# EAGLE design eggbothat (EAGLE 7.7.0)

## Sheet 1 of 2
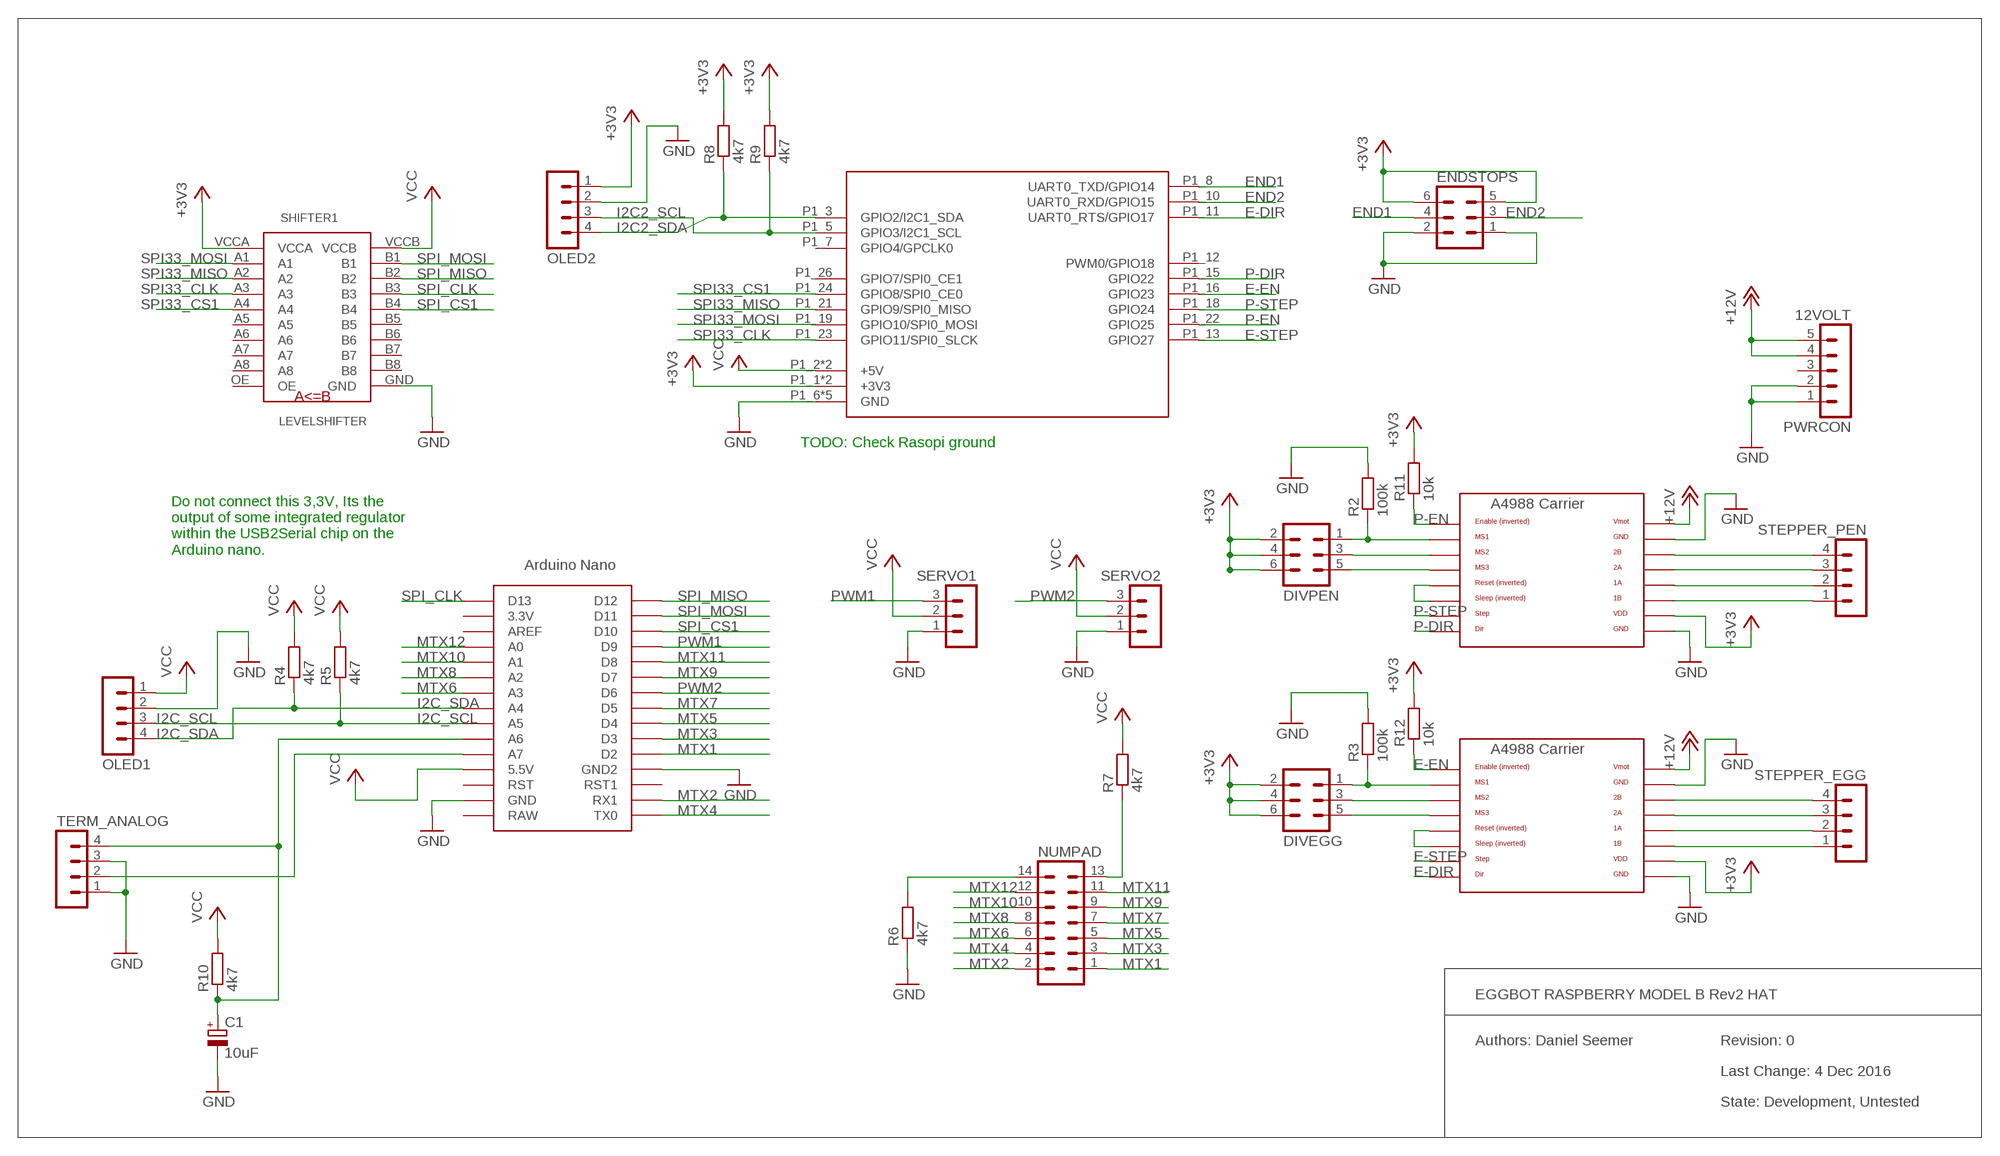
[diagram p0: schematic, sheet 1]

### Parts
12VOLT  PWRCON  MA05-1  [MA05-1]
C1  10uF  CPOL-EUE2.5-5  [E2,5-5]
DIVEGG  MA03-2  [MA03-2]
DIVPEN  MA03-2  [MA03-2]
ENDSTOPS  MA03-2  [MA03-2]
NUMPAD  MA07-2  [MA07-2]
OLED1  MA04-1  [MA04-1]
OLED2  MA04-1  [MA04-1]
R2  100k  R-EU_R1206  [R1206]
R3  100k  R-EU_R1206  [R1206]
R4  4k7  R-EU_R1206  [R1206]
R5  4k7  R-EU_R1206  [R1206]
R6  4k7  R-EU_R1206  [R1206]
R7  4k7  R-EU_R1206  [R1206]
R8  4k7  R-EU_R1206  [R1206]
R9  4k7  R-EU_R1206  [R1206]
R10  4k7  R-EU_R1206  [R1206]
R11  10k  R-EU_R1206  [R1206]
R12  10k  R-EU_R1206  [R1206]
RASPBERRY  RPI-B-V2SHIELD  [RPI-B-V2-SHIELD]
SERVO1  MA03-1  [MA03-1]
SERVO2  MA03-1  [MA03-1]
SHIFTER1  LEVELSHIFTER  [PLUG_20_S4]
STEPPER_EGG  MA04-1  [MA04-1]
STEPPER_PEN  MA04-1  [MA04-1]
TERM_ANALOG  MA04-1  [MA04-1]
U$1  A4988BREAKOUT  [A4988BREAKOUT]
U$2  A4988BREAKOUT  [A4988BREAKOUT]
U$4  NANO  [NANO]

### Nets
+3V3: DIVEGG.2 DIVEGG.4 DIVEGG.6 DIVPEN.2 DIVPEN.4 DIVPEN.6 ENDSTOPS.5 ENDSTOPS.6 OLED2.1 R8.2 R9.2 R11.2 R12.2 RASPBERRY.P1_1(+3V3) RASPBERRY.P1_17(+3V3) SHIFTER1.VCCA U$1.VDD U$2.VDD
+12V: 12VOLT.4 12VOLT.5 U$1.VMOT U$2.VMOT
E-DIR: RASPBERRY.P1_11(UART0_RTS/GPIO17) U$2.DIR
E-EN: R12.1 RASPBERRY.P1_16(GPIO23) U$2.EN
E-STEP: RASPBERRY.P1_13(GPIO27) U$2.STEP
END1: ENDSTOPS.4 RASPBERRY.P1_8(UART0_TXD/GPIO14)
END2: ENDSTOPS.3 RASPBERRY.P1_10(UART0_RXD/GPIO15)
GND: 12VOLT.1 12VOLT.2 C1.- ENDSTOPS.1 ENDSTOPS.2 OLED1.2 OLED2.2 R2.2 R3.2 R6.1 RASPBERRY.P1_6(GND) RASPBERRY.P1_9(GND) RASPBERRY.P1_14(GND) RASPBERRY.P1_20(GND) RASPBERRY.P1_25(GND) SERVO1.1 SERVO2.1 SHIFTER1.GND TERM_ANALOG.1 TERM_ANALOG.3 U$1.GND U$1.GND@0(GND) U$2.GND U$2.GND@0(GND) U$4.GND U$4.GND1(GND2)
I2C2_SCL: OLED2.3 R9.1 RASPBERRY.P1_5(GPIO3/I2C1_SCL)
I2C2_SDA: OLED2.4 R8.1 RASPBERRY.P1_3(GPIO2/I2C1_SDA)
I2C_SCL: OLED1.3 R5.1 U$4.A5
I2C_SDA: OLED1.4 R4.1 U$4.A4
MTX1: NUMPAD.1 U$4.D2
MTX2: NUMPAD.2 U$4.RX1
MTX3: NUMPAD.3 U$4.D3
MTX4: NUMPAD.4 U$4.TX0
MTX5: NUMPAD.5 U$4.D4
MTX6: NUMPAD.6 U$4.A3
MTX7: NUMPAD.7 U$4.D5
MTX8: NUMPAD.8 U$4.A2
MTX9: NUMPAD.9 U$4.D7
MTX10: NUMPAD.10 U$4.A1
MTX11: NUMPAD.11 U$4.D8
MTX12: NUMPAD.12 U$4.A0
N$1: STEPPER_PEN.4 U$1.2B
N$2: STEPPER_PEN.3 U$1.2A
N$3: STEPPER_PEN.2 U$1.1A
N$4: STEPPER_PEN.1 U$1.1B
N$5: STEPPER_EGG.4 U$2.2B
N$6: STEPPER_EGG.3 U$2.2A
N$7: STEPPER_EGG.2 U$2.1A
N$8: STEPPER_EGG.1 U$2.1B
N$9: DIVPEN.3 U$1.MS2
N$10: DIVPEN.1 R2.1 U$1.MS1
N$11: DIVPEN.5 U$1.MS3
N$12: DIVEGG.3 U$2.MS2
N$13: DIVEGG.1 R3.1 U$2.MS1
N$14: DIVEGG.5 U$2.MS3
N$16: NUMPAD.13 R7.1
N$17: NUMPAD.14 R6.2
N$18: U$1.RST U$1.SLP(SLEEP)
N$19: U$2.RST U$2.SLP(SLEEP)
N$20: C1.+ R10.1 TERM_ANALOG.4 U$4.A6
N$21: TERM_ANALOG.2 U$4.A7
P-DIR: RASPBERRY.P1_15(GPIO22) U$1.DIR
P-EN: R11.1 RASPBERRY.P1_22(GPIO25) U$1.EN
P-STEP: RASPBERRY.P1_18(GPIO24) U$1.STEP
PWM1: SERVO1.3 U$4.D9
PWM2: SERVO2.3 U$4.D6
SPI33_CLK: RASPBERRY.P1_23(GPIO11/SPI0_SLCK) SHIFTER1.A3
SPI33_CS1: RASPBERRY.P1_24(GPIO8/SPI0_CE0) SHIFTER1.A4
SPI33_MISO: RASPBERRY.P1_21(GPIO9/SPI0_MISO) SHIFTER1.A2
SPI33_MOSI: RASPBERRY.P1_19(GPIO10/SPI0_MOSI) SHIFTER1.A1
SPI_CLK: SHIFTER1.B3 U$4.D13
SPI_CS1: SHIFTER1.B4 U$4.D10
SPI_MISO: SHIFTER1.B2 U$4.D12
SPI_MOSI: SHIFTER1.B1 U$4.D11
VCC: OLED1.1 R4.2 R5.2 R7.2 R10.2 RASPBERRY.P1_2(+5V) RASPBERRY.P1_4(+5V) SERVO1.2 SERVO2.2 SHIFTER1.VCCB U$4.5V(5.5V)
Unconnected: 12VOLT.3 RASPBERRY.P1_7(GPIO4/GPCLK0) RASPBERRY.P1_12(PWM0/GPIO18) RASPBERRY.P1_26(GPIO7/SPI0_CE1) SHIFTER1.A5 SHIFTER1.A6 SHIFTER1.A7 SHIFTER1.A8 SHIFTER1.B5 SHIFTER1.B6 SHIFTER1.B7 SHIFTER1.B8 SHIFTER1.OE U$4.3.3V U$4.AREF U$4.RAW U$4.RST U$4.RST1

### Notes on the sheet
- TODO: Check Rasopi ground
- Do not connect this 3,3V, Its the
  output of some integrated regulator
  within the USB2Serial chip on the
  Arduino nano.
- EGGBOT RASPBERRY MODEL B Rev2 HAT
- Authors: Daniel Seemer | Revision: 0
- Last Change: 4 Dec 2016
- State: Development, Untested

## Sheet 2 of 2

## Library data of the parts
12VOLT = con-lstb:MA05-1: PIN HEADER; OC_FARNELL: unknown; OC_NEWARK: unknown
C1 = rcl:CPOL-EU: POLARIZED CAPACITOR, European symbol
DIVEGG DIVPEN ENDSTOPS = con-lstb:MA03-2: PIN HEADER; OC_FARNELL: unknown; OC_NEWARK: unknown
NUMPAD = con-lstb:MA07-2: PIN HEADER; OC_FARNELL: unknown; OC_NEWARK: unknown
OLED1 OLED2 STEPPER_EGG STEPPER_PEN TERM_ANALOG = con-lstb:MA04-1: PIN HEADER; OC_FARNELL: unknown; OC_NEWARK: unknown
R2-R12 = rcl:R-EU_: RESISTOR, European symbol
RASPBERRY = levelshifter:RPI-B-V2: Second revision of the Model 2 board including the P5 and P6 headers. Mounting holes have been added. Choose the "SHIELD" variant for a predefined Dimension layer and drilling holes. Theres also a "SHIELD" variant for the Model A without a RJ45 connector.
SERVO1 SERVO2 = con-lstb:MA03-1: PIN HEADER; OC_FARNELL: unknown; OC_NEWARK: unknown
SHIFTER1 = levelshifter:LEVELSHIFTER
U$1 U$2 = RepRapjr:A4988BREAKOUT
U$4 = levelshifter:NANO: Arduino Nano

## Board
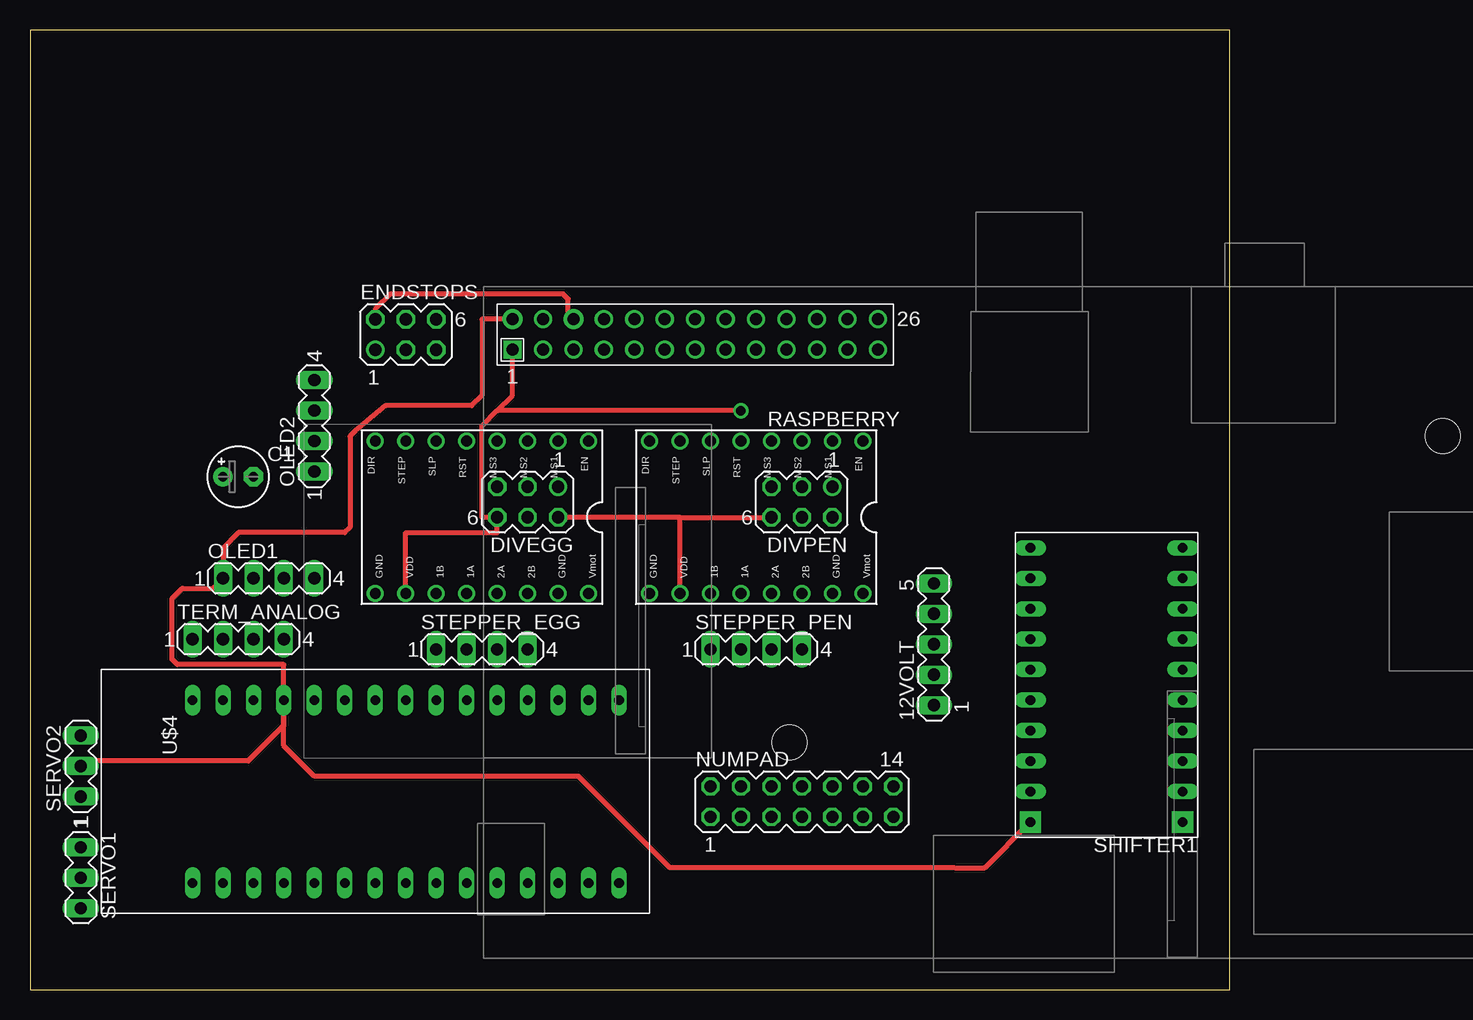
[diagram p1: board, top side]
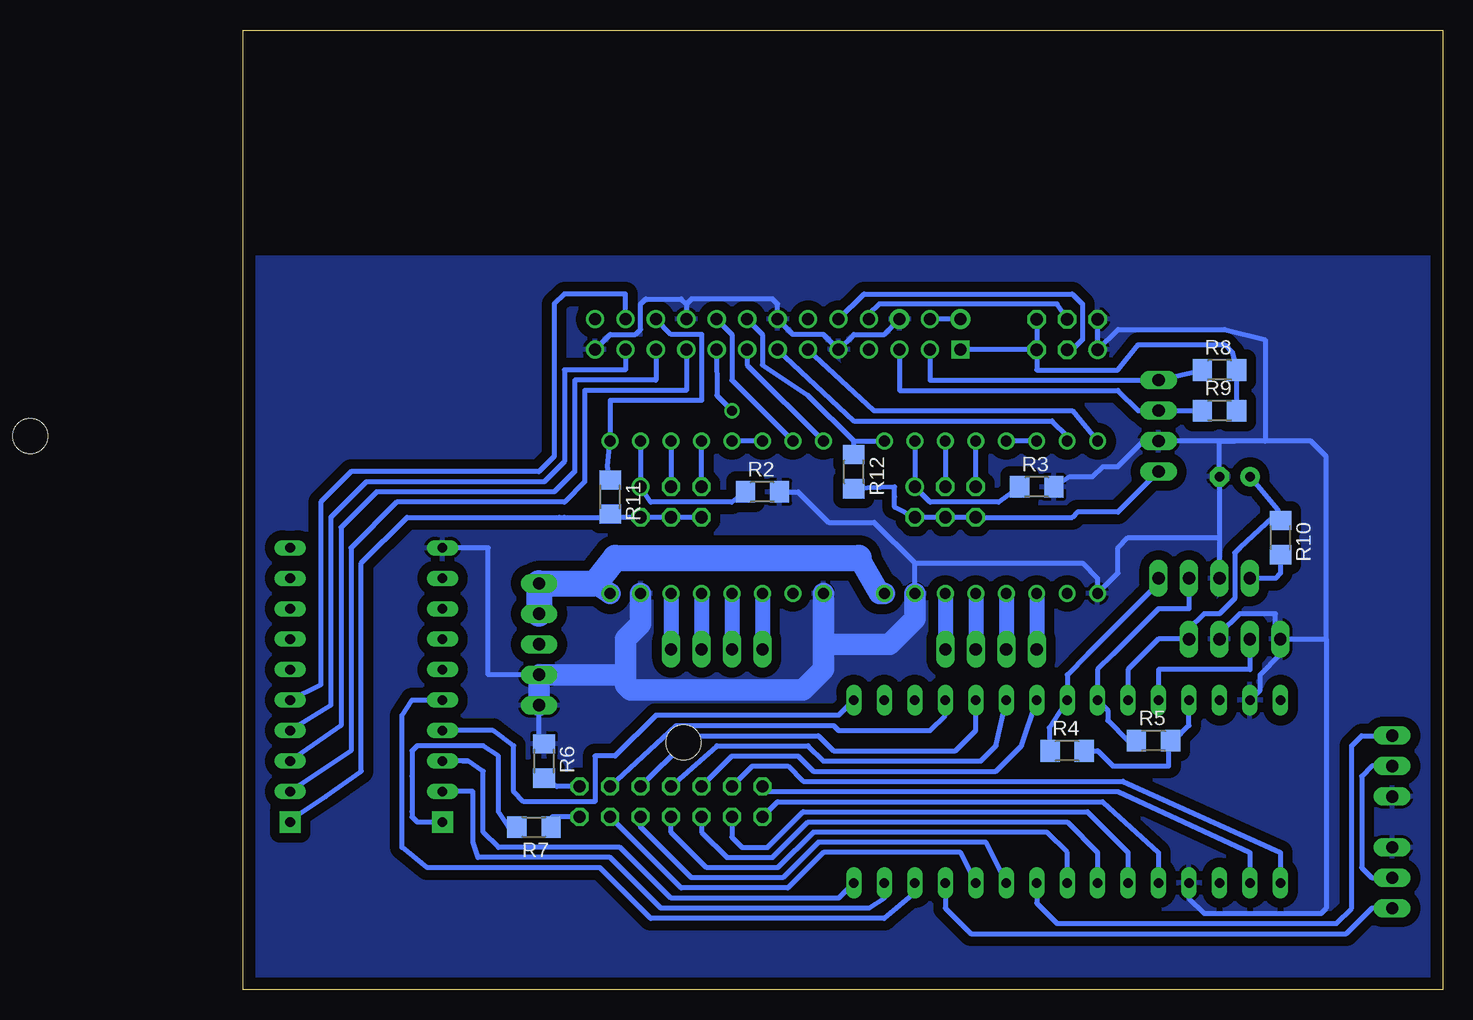
[diagram p2: board, bottom side, seen from below]

Size 100 x 80 mm. Coordinates in mm from the lower left corner, seen from the top.
Outline: 0,0 100,0 100,80 0,80 0,0
Copper layers (1*16): Top 0.035mm / dielectric 1.5mm / Bottom 0.035mm
Design rules "default": minimum track width 10mil, minimum drill 24mil, track to track 8mil, track to pad 8mil, pad to pad 8mil, via to via 8mil, smd to smd 8mil, copper to edge 40mil, drill to drill 8mil, minimum pad ring 10mil, minimum via ring 8mil, stop-mask expansion 4mil, vias tented up to drill 0mil, thermal gap 10mil

### Footprints (pad centres in the part's own frame; a part is rotated, then mirrored left to right if it is on the bottom)
MA05-1 = drill 1.016 long: 1 -5.08,0; 2 -2.54,0; 3 0,0; 4 2.54,0; 5 5.08,0
E2,5-5 = drill 0.813 pad 1.6: + -1.27,0 | drill 0.813 pad 1.6 octagon: - 1.27,0
MA03-2 = drill 1.016: 1 -2.54,-1.27 | drill 1.016 octagon: 2 -2.54,1.27; 3 0,-1.27; 4 0,1.27; 5 2.54,-1.27; 6 2.54,1.27
MA07-2 = drill 1.016 octagon: 1 -7.62,-1.27; 2 -7.62,1.27; 3 -5.08,-1.27; 4 -5.08,1.27; 5 -2.54,-1.27; 6 -2.54,1.27; 7 0,-1.27; 8 0,1.27; 9 2.54,-1.27; 10 2.54,1.27; 11 5.08,-1.27; 12 5.08,1.27; 13 7.62,-1.27; 14 7.62,1.27
MA04-1 = drill 1.016 long: 1 -3.81,0; 2 -1.27,0; 3 1.27,0; 4 3.81,0
R1206 = smd 1.6 x 1.803: 1 -1.422,0; 2 1.422,0
RPI-B-V2-SHIELD = drill 1 square: P1_1 0,0 | drill 1 pad 1.676: P1_2 0,2.54; P1_6 5.08,2.54 | drill 1: P1_3 2.54,0; P1_4 2.54,2.54; P1_5 5.08,0; P1_7 7.62,0; P1_8 7.62,2.54; P1_9 10.16,0; P1_10 10.16,2.54; P1_11 12.7,0; P1_12 12.7,2.54; P1_13 15.24,0; P1_14 15.24,2.54; P1_15 17.78,0; P1_16 17.78,2.54; P1_17 20.32,0; P1_18 20.32,2.54; P1_19 22.86,0; P1_20 22.86,2.54; P1_21 25.4,0; P1_22 25.4,2.54; P1_23 27.94,0; P1_24 27.94,2.54; P1_25 30.48,0; P1_26 30.48,2.54 | hole 2.9: 23.1,-32.72; 77.57,-7.21
MA03-1 = drill 1.016 long: 1 -2.54,0; 2 0,0; 3 2.54,0
PLUG_20_S4 = drill 0.8 long: A1 1.27,-3.81; A2 1.27,-6.35; A3 1.27,-8.89; A4 1.27,-11.43; A5 1.27,-13.97; A6 1.27,-16.51; A7 1.27,-19.05; A8 1.27,-21.59; B1 13.97,-3.81; B2 13.97,-6.35; B3 13.97,-8.89; B4 13.97,-11.43; B5 13.97,-13.97; B6 13.97,-16.51; B7 13.97,-19.05; B8 13.97,-21.59; GND 13.97,-24.13; OE 1.27,-24.13 | drill 0.8 pad 1.778 square: VCCA 1.27,-1.27; VCCB 13.97,-1.27
A4988BREAKOUT = drill 0.9: 1A 8.89,1.27; 1B 11.43,1.27; 2A 6.35,1.27; 2B 3.81,1.27; DIR 16.51,-11.43; EN -1.27,-11.43; GND 16.51,1.27; GND@0 1.27,1.27; MS1 1.27,-11.43; MS2 3.81,-11.43; MS3 6.35,-11.43; RST 8.89,-11.43; SLP 11.43,-11.43; STEP 13.97,-11.43; VDD 13.97,1.27; VMOT -1.27,1.27
NANO = drill 0.8 long: 3.3V -10.16,24.13; 5V -10.16,-1.27; A0 -10.16,19.05; A1 -10.16,16.51; A2 -10.16,13.97; A3 -10.16,11.43; A4 -10.16,8.89; A5 -10.16,6.35; A6 -10.16,3.81; A7 -10.16,1.27; AREF -10.16,21.59; D2 5.08,1.27; D3 5.08,3.81; D4 5.08,6.35; D5 5.08,8.89; D6 5.08,11.43; D7 5.08,13.97; D8 5.08,16.51; D9 5.08,19.05; D10 5.08,21.59; D11 5.08,24.13; D12 5.08,26.67; D13 -10.16,26.67; GND -10.16,-6.35; GND1 5.08,-1.27; RAW -10.16,-8.89; RST -10.16,-3.81; RST1 5.08,-3.81; RX1 5.08,-6.35; TX0 5.08,-8.89

### Placement (x,y rotation side)
12VOLT  75.35,28.79 90 top
C1  17.36,42.76 0 top
DIVEGG  41.49,40.64 180 top
DIVPEN  64.35,40.64 180 top
ENDSTOPS  31.33,54.61 0 top
NUMPAD  64.35,15.66 0 top
OLED1  19.9,34.29 0 top
OLED2  23.71,46.99 90 top
R2  56.73,41.49 0 bottom
R3  33.87,41.91 0 bottom
R4  31.33,19.9 0 bottom
R5  24.13,20.74 0 bottom
R6  74.93,19.05 270 bottom
R7  75.78,13.55 180 bottom
R8  18.63,51.65 0 bottom
R9  18.63,48.26 0 bottom
R10  13.55,37.68 270 bottom
R11  69.43,41.06 270 bottom
R12  49.11,43.18 270 bottom
RASPBERRY  40.22,53.34 0 top
SERVO1  4.23,9.31 270 top
SERVO2  4.23,18.63 90 top
SHIFTER1  97.37,12.7 180 top
STEPPER_EGG  37.68,28.36 0 top
STEPPER_PEN  60.54,28.36 0 top
TERM_ANALOG  17.36,29.21 0 top
U$1  68.16,34.29 180 top
U$2  45.3,34.29 180 top
U$4  22.44,13.97 270 top

### Tracks (layer width: path | path; a pad name or v marks a point on that pad's centre or on a via)
+3V3  (via drill 0.8 pad 1.27)
  Top 0.406: 60.54,39.37 | 60.54,39.37 DIVPEN.6 54.19,39.37 | U$1.VDD 54.19,39.37 | 54.19,39.37 | U$2.VDD 31.33,38.1 38.95,38.1 DIVEGG.6 37.68,39.37 37.68,46.99 38.95,48.26 | 38.95,48.26 40.22,49.53 RASPBERRY.P1_1 | 54.19,39.37 DIVEGG.2 | v59.27,48.26 38.95,48.26
  Bottom 0.406: 69.43,39.37 R11.2 | DIVPEN.6 DIVPEN.4 DIVPEN.2 69,39.37 69.43,39.37 | ENDSTOPS.6 ENDSTOPS.5 | ENDSTOPS.5 RASPBERRY.P1_1 | OLED2.1 27.09,39.79 30.48,39.79 30.9,39.37 38.52,39.37 DIVEGG.6 DIVEGG.4 DIVEGG.2 45.72,40.22 45.72,41.06 45.72,41.91 R12.2 49.26,41.91 | ENDSTOPS.5 | ENDSTOPS.5 33.87,51.65 27.09,51.65 25.4,53.76 18.2,53.76 17.55,53.11 R8.2 R9.2 | SHIFTER1.VCCA 95.67,14.39 93.13,16.09 90.17,18.2 90.17,35.56 86.36,39.37 73.66,39.37 73.24,39.37 69.43,39.37 | RASPBERRY.P1_17 60.54,49.53 v59.27,48.26
+12V
  Bottom 1.778: U$1.VMOT 70.7,33.87 | 48.68,35.98 46.99,33.02 U$2.VMOT
  Bottom 2.184: 12VOLT.4 12VOLT.5 70.7,33.87 69,35.98 48.68,35.98
E-DIR
  Bottom 0.406: RASPBERRY.P1_11 47.41,48.26 30.9,48.26 U$2.DIR | U$2.DIR
E-EN
  Bottom 0.406: RASPBERRY.P1_16 56.73,54.61 56.73,52.07 52.92,49.53 49.11,45.72 | 49.11,45.72 U$2.EN | R12.1 49.11,45.52 49.11,45.72
E-STEP
  Bottom 0.406: RASPBERRY.P1_13 49.11,47.41 32.6,47.41 31.33,46.14 U$2.STEP
END1
  Bottom 0.406: ENDSTOPS.4 32.17,57.15 46.99,57.15 47.84,56.3 RASPBERRY.P1_8
END2
  Bottom 0.406: RASPBERRY.P1_10 48.26,58 30.9,58 30.06,57.15 30.06,54.19 30.9,53.34 ENDSTOPS.3
GND
  Top 0.406: RASPBERRY.P1_6 44.87,56.3 44.87,57.57 44.45,58 30.06,58 28.79,56.73 ENDSTOPS.2
  Bottom 0.406: ENDSTOPS.2 ENDSTOPS.1 27.09,55.03 18.2,55.03 14.82,54.19 14.82,45.72 | 18.63,45.72 C1.- 18.63,37.68 | 17.36,45.72 18.63,45.72 | 18.63,45.72 17.36,45.72 | 17.36,45.72 OLED2.2 24.98,45.72 27.09,43.6 28.36,43.6 29.21,42.76 31.13,42.76 R3.2 | 18.63,37.68 OLED1.2 | TERM_ANALOG.1 13.97,29.63 13.97,31.33 16.93,31.33 18.63,29.63 TERM_ANALOG.3 | U$4.GND 15.24,24.98 15.24,26.25 13.55,27.94 TERM_ANALOG.1 | 18.63,37.68 26.25,37.68 27.09,36.83 27.09,34.71 U$2.GND 28.79,34.29 30.06,35.56 44.03,35.56 | 12VOLT.2 79.59,26.25 79.59,36.83 SHIFTER1.GND | R6.1 75.35,20.32 12VOLT.1 | U$2.GND@0 44.03,35.56 | 9.74,29.21 9.74,6.77 10.16,6.35 19.9,6.35 21.17,7.62 U$4.GND1 | RASPBERRY.P1_9 | RASPBERRY.P1_9 51.65,54.61 54.19,54.61 | 54.19,54.61 | 54.19,54.61 RASPBERRY.P1_14 55.46,57.15 55.88,57.57 62.65,57.57 63.08,57.15 | RASPBERRY.P1_9 49.11,54.61 46.57,54.61 RASPBERRY.P1_6 | RASPBERRY.P1_25 69.43,54.61 67.31,54.61 66.89,55.03 66.89,57.15 66.46,57.57 63.5,57.57 63.08,57.15 | 63.08,57.15 RASPBERRY.P1_20 | TERM_ANALOG.1 9.74,29.21 | 9.74,29.21 9.74,44.45 11.01,45.72 14.82,45.72 | 14.82,45.72 17.36,45.72 | R2.2 53.76,41.49 51.22,38.95 47.41,38.95 44.03,35.56
  Bottom 1.778: 12VOLT.1 12VOLT.2 68.58,26.25 68.16,26.67 | 68.16,26.67 68.16,29.21 66.89,30.48 U$1.GND@0 | 68.16,26.67 68.16,25.4 67.73,24.98 53.34,24.98 51.65,26.67 51.65,28.79 | 51.65,28.79 U$1.GND | U$2.GND@0 44.03,30.9 46.14,28.79 51.65,28.79
  pour Bottom (isolate 0.813): 0.42,60.96 101.18,60.96 101.18,0 0.42,0
I2C2_SCL
  Bottom 0.406: RASPBERRY.P1_5 45.3,49.95 27.09,49.95 25.4,48.26 OLED2.3 R9.1
I2C2_SDA
  Bottom 0.406: RASPBERRY.P1_3 42.76,50.8 26.25,50.8 25.82,50.8 OLED2.4 R8.1
I2C_SCL
  Bottom 0.406: OLED1.3 21.17,31.75 23.71,31.75 27.52,27.94 28.79,26.67 U$4.A5 27.94,23.28 27.94,22.44 26.25,20.74 R5.1
I2C_SDA
  Bottom 0.406: OLED1.4 23.71,33.87 29.63,27.94 31.33,26.25 U$4.A4 32.82,21.82 R4.1
MTX1
  Bottom 0.406: NUMPAD.1 55.46,15.66 28.36,15.66 23.71,11.43 U$4.D2
MTX2
  Bottom 0.406: NUMPAD.2 56.3,16.51 27.09,16.51 16.09,11.43 U$4.RX1
MTX3
  Bottom 0.406: NUMPAD.3 59.27,12.7 58.42,11.85 56.3,11.85 53.34,14.82 29.63,14.82 26.25,11.43 U$4.D3
MTX4
  Bottom 0.406: NUMPAD.4 57.57,18.63 54.61,18.63 53.34,17.36 26.67,17.36 13.55,11.43 U$4.TX0
MTX5
  Bottom 0.406: NUMPAD.5 61.81,13.12 59.69,11.01 56.73,11.01 55.88,11.01 52.92,13.97 31.33,13.97 28.79,11.43 U$4.D4
MTX6
  Bottom 0.406: NUMPAD.6 59.27,19.47 53.76,19.47 52.49,18.2 37.25,18.2 35.14,20.32 U$4.A3
MTX7
  Bottom 0.406: U$4.D5 31.33,11.43 33.02,13.12 52.49,13.12 55.46,10.16 61.38,10.16 64.35,13.12 NUMPAD.7
MTX8
  Bottom 0.406: NUMPAD.8 60.54,20.32 52.92,20.32 51.65,19.05 38.52,19.05 37.25,20.32 U$4.A2
MTX9
  Bottom 0.406: U$4.D7 38.1,12.28 52.07,12.28 55.03,9.31 62.65,9.31 66.89,13.55 NUMPAD.9
MTX10
  Bottom 0.406: NUMPAD.10 63.08,20.74 62.65,21.17 52.07,21.17 50.8,19.9 40.64,19.9 38.95,21.59 U$4.A1
MTX11
  Bottom 0.406: U$4.D8 40.22,11.43 51.65,11.43 54.61,8.47 63.5,8.47 69,13.97 NUMPAD.11
MTX12
  Bottom 0.406: NUMPAD.12 63.92,22.01 50.8,22.01 50.38,21.59 42.76,21.59 41.49,22.86 U$4.A0
N$1
  Bottom 1.27: U$1.2B STEPPER_PEN.4
N$2
  Bottom 1.27: U$1.2A STEPPER_PEN.3
N$3
  Bottom 1.27: U$1.1A STEPPER_PEN.2
N$4
  Bottom 1.27: U$1.1B STEPPER_PEN.1
N$5
  Bottom 1.27: U$2.2B STEPPER_EGG.4
N$6
  Bottom 1.27: U$2.2A STEPPER_EGG.3
N$7
  Bottom 1.27: U$2.1A STEPPER_EGG.2
N$8
  Bottom 1.27: U$2.1B STEPPER_EGG.1
N$9
  Bottom 0.406: U$1.MS2 DIVPEN.3
N$10
  Bottom 0.406: U$1.MS1 DIVPEN.1 66.04,40.64 59.27,40.64 R2.1
N$11
  Bottom 0.406: DIVPEN.5 U$1.MS3
N$12
  Bottom 0.406: U$2.MS2 DIVEGG.3
N$13
  Bottom 0.406: U$2.MS1 DIVEGG.1 | R3.1 37.03,40.64 42.76,40.64 DIVEGG.1 | DIVEGG.1
N$14
  Bottom 0.406: DIVEGG.5 U$2.MS3
N$16
  Bottom 0.406: NUMPAD.13 74.28,14.39 R7.1
N$17
  Bottom 0.406: NUMPAD.14 73.89,16.93 R6.2
N$18
  Bottom 0.406: U$1.SLP U$1.RST
N$19
  Bottom 0.406: U$2.SLP U$2.RST
N$20
  Bottom 0.406: U$4.A6 26.25,26.67 23.71,29.21 TERM_ANALOG.4 21.17,30.06 19.9,31.33 18.63,31.33 17.36,32.6 17.36,36.41 16.93,36.83 14.2,39.37 R10.1 13.77,39.99 C1.+
N$21
  Bottom 0.406: TERM_ANALOG.2 16.09,26.67 23.71,26.67 U$4.A7
P-DIR
  Bottom 0.406: RASPBERRY.P1_15 58,52.07 U$1.DIR
P-EN
  Bottom 0.406: R11.1 69.65,43.6 U$1.EN 69.43,49.11 61.81,49.11 61.81,49.53 61.81,54.61 64.35,54.61 RASPBERRY.P1_22
P-STEP
  Bottom 0.406: RASPBERRY.P1_18 59.27,54.61 59.27,50.8 U$1.STEP
PWM1
  Bottom 0.406: U$4.D9 41.49,6.77 39.37,4.66 8.04,4.66 5.93,6.77 SERVO1.3
PWM2
  Bottom 0.406: U$4.D6 | U$4.D6 33.87,7.2 32.17,5.5 8.89,5.5 7.62,6.77 7.62,20.32 6.77,21.17 SERVO2.3 | SERVO2.3
SPI33_CLK
  Bottom 0.406: RASPBERRY.P1_23 68.16,51.65 73.24,51.65 73.24,44.03 74.93,42.33 89.75,42.33 92.71,39.37 92.71,23.71 SHIFTER1.A3
SPI33_CS1
  Bottom 0.406: RASPBERRY.P1_24 68.16,58 73.24,58 74.08,57.15 74.08,44.45 75.35,43.18 91.02,43.18 93.56,40.64 93.56,25.4 SHIFTER1.A4
SPI33_MISO
  Bottom 0.406: RASPBERRY.P1_21 65.62,50.8 72.39,50.8 72.39,43.18 74.08,41.49 88.9,41.49 91.86,38.52 91.86,22.01 SHIFTER1.A2
SPI33_MOSI
  Bottom 0.406: RASPBERRY.P1_19 63.08,49.95 71.54,49.95 71.54,42.33 73.24,40.64 87.21,40.64 91.02,36.83 91.02,19.9 SHIFTER1.A1
SPI_CLK
  Bottom 0.406: U$4.D13 50.38,22.86 65.62,22.86 69,19.47 70.7,19.47 70.7,15.66 76.62,15.66 77.47,16.51 77.47,20.32 79.16,21.59 SHIFTER1.B3
SPI_CS1
  Bottom 0.406: U$4.D10 44.03,8.04 46.57,5.93 66.04,5.93 70.27,10.16 84.67,10.16 86.78,11.85 86.78,22.86 85.94,24.13 SHIFTER1.B4
SPI_MISO
  Bottom 0.406: U$4.D12 50.38,7.62 64.35,7.62 68.58,11.85 78.74,11.85 80.01,13.12 80.01,18.2 | 80.01,18.2 | 80.01,18.2 81.28,19.05 | 81.28,19.05 | 81.28,19.05 81.7,19.05 81.28,19.05 | 81.28,19.05 | 81.28,19.05 SHIFTER1.B2
SPI_MOSI
  Bottom 0.406: U$4.D11 46.57,7.62 47.84,6.77 65.19,6.77 69.43,11.01 80.43,11.01 80.86,12.28 80.86,16.51 SHIFTER1.B1
VCC
  Top 0.406: RASPBERRY.P1_2 37.68,55.88 37.68,49.53 36.83,48.68 29.63,48.68 27.09,46.57 26.67,46.14 26.67,38.52 26.25,38.1 17.36,38.1 16.09,36.83 OLED1.1 15.24,33.44 12.7,33.44 11.85,32.6 11.85,27.52 12.28,27.09 21.17,27.09 | 77.05,10.16 79.59,10.16 SHIFTER1.VCCB | 77.05,10.16 53.34,10.16 45.72,17.78 23.71,17.78 | 77.05,10.16 | 23.71,17.78 | 23.71,17.78 21.17,20.32 U$4.5V | U$4.5V 21.17,27.09 | 21.17,27.09 | U$4.5V 21.17,22.01 18.2,19.05 4.66,19.05 SERVO2.2 | SERVO2.2 | SERVO2.2 | U$4.5V
  Bottom 0.406: RASPBERRY.P1_2 RASPBERRY.P1_4 | R10.2 13.55,34.94 13.55,34.71 13.97,34.29 OLED1.1 | OLED1.1 | 22.86,20.74 | 22.86,20.74 | 22.86,20.74 | 22.86,20.74 R5.2 22.86,20.59 22.86,18.63 | R7.2 77.89,13.55 78.74,14.82 78.74,19.47 80.01,20.32 85.51,20.32 | 85.51,20.32 | 85.51,20.32 85.94,19.9 85.94,17.78 85.94,14.82 85.94,14.39 85.51,13.97 83.82,13.97 SHIFTER1.VCCB | SHIFTER1.VCCB | 22.86,20.74 22.44,20.74 21.17,22.01 U$4.5V | SERVO2.2 5.93,18.63 6.77,17.78 6.77,10.16 5.93,9.31 SERVO1.2 | SERVO1.2 | R4.2 28.79,19.9 27.94,19.05 | 27.94,19.05 | 27.94,19.05 27.52,18.63 22.86,18.63 | 22.86,18.63